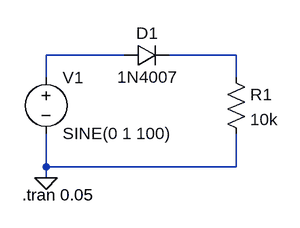
[diagram p0: schematic (1) Half wave rectifier.asc]
(1) Half wave rectifier.asc, the LTspice schematic file:
Version 4
SHEET 1 880 680
WIRE 96 112 -16 112
WIRE 256 112 160 112
WIRE -16 144 -16 112
WIRE 256 144 256 112
WIRE -16 272 -16 224
WIRE 256 272 256 224
WIRE 256 272 -16 272
WIRE -16 288 -16 272
FLAG -16 288 0
SYMBOL diode 96 128 R270
WINDOW 0 32 32 VTop 2
WINDOW 3 0 32 VBottom 2
SYMATTR InstName D1
SYMATTR Value 1N4007
SYMBOL voltage -16 128 R0
WINDOW 123 0 0 Left 0
WINDOW 39 0 0 Left 0
SYMATTR InstName V1
SYMATTR Value SINE(0 1 100)
SYMBOL res 240 128 R0
SYMATTR InstName R1
SYMATTR Value 10k
TEXT -50 312 Left 2 !.tran 0.05

The netlist it stands for:
* (1) Half wave rectifier.asc
D1 N001 N002 1N4007
V1 N001 0 SINE(0 1 100)
R1 N002 0 10k
.model D D
.lib standard.dio
.tran 0.05
.backanno
.end